# Altium schematic sheet SMPS.SchDoc
size A3; Organization: Altium Limited; Address1: L3, 12a Rodborough Rd; Address2: Frenchs Forest; Address3: NSW; Address4: Australia 2086
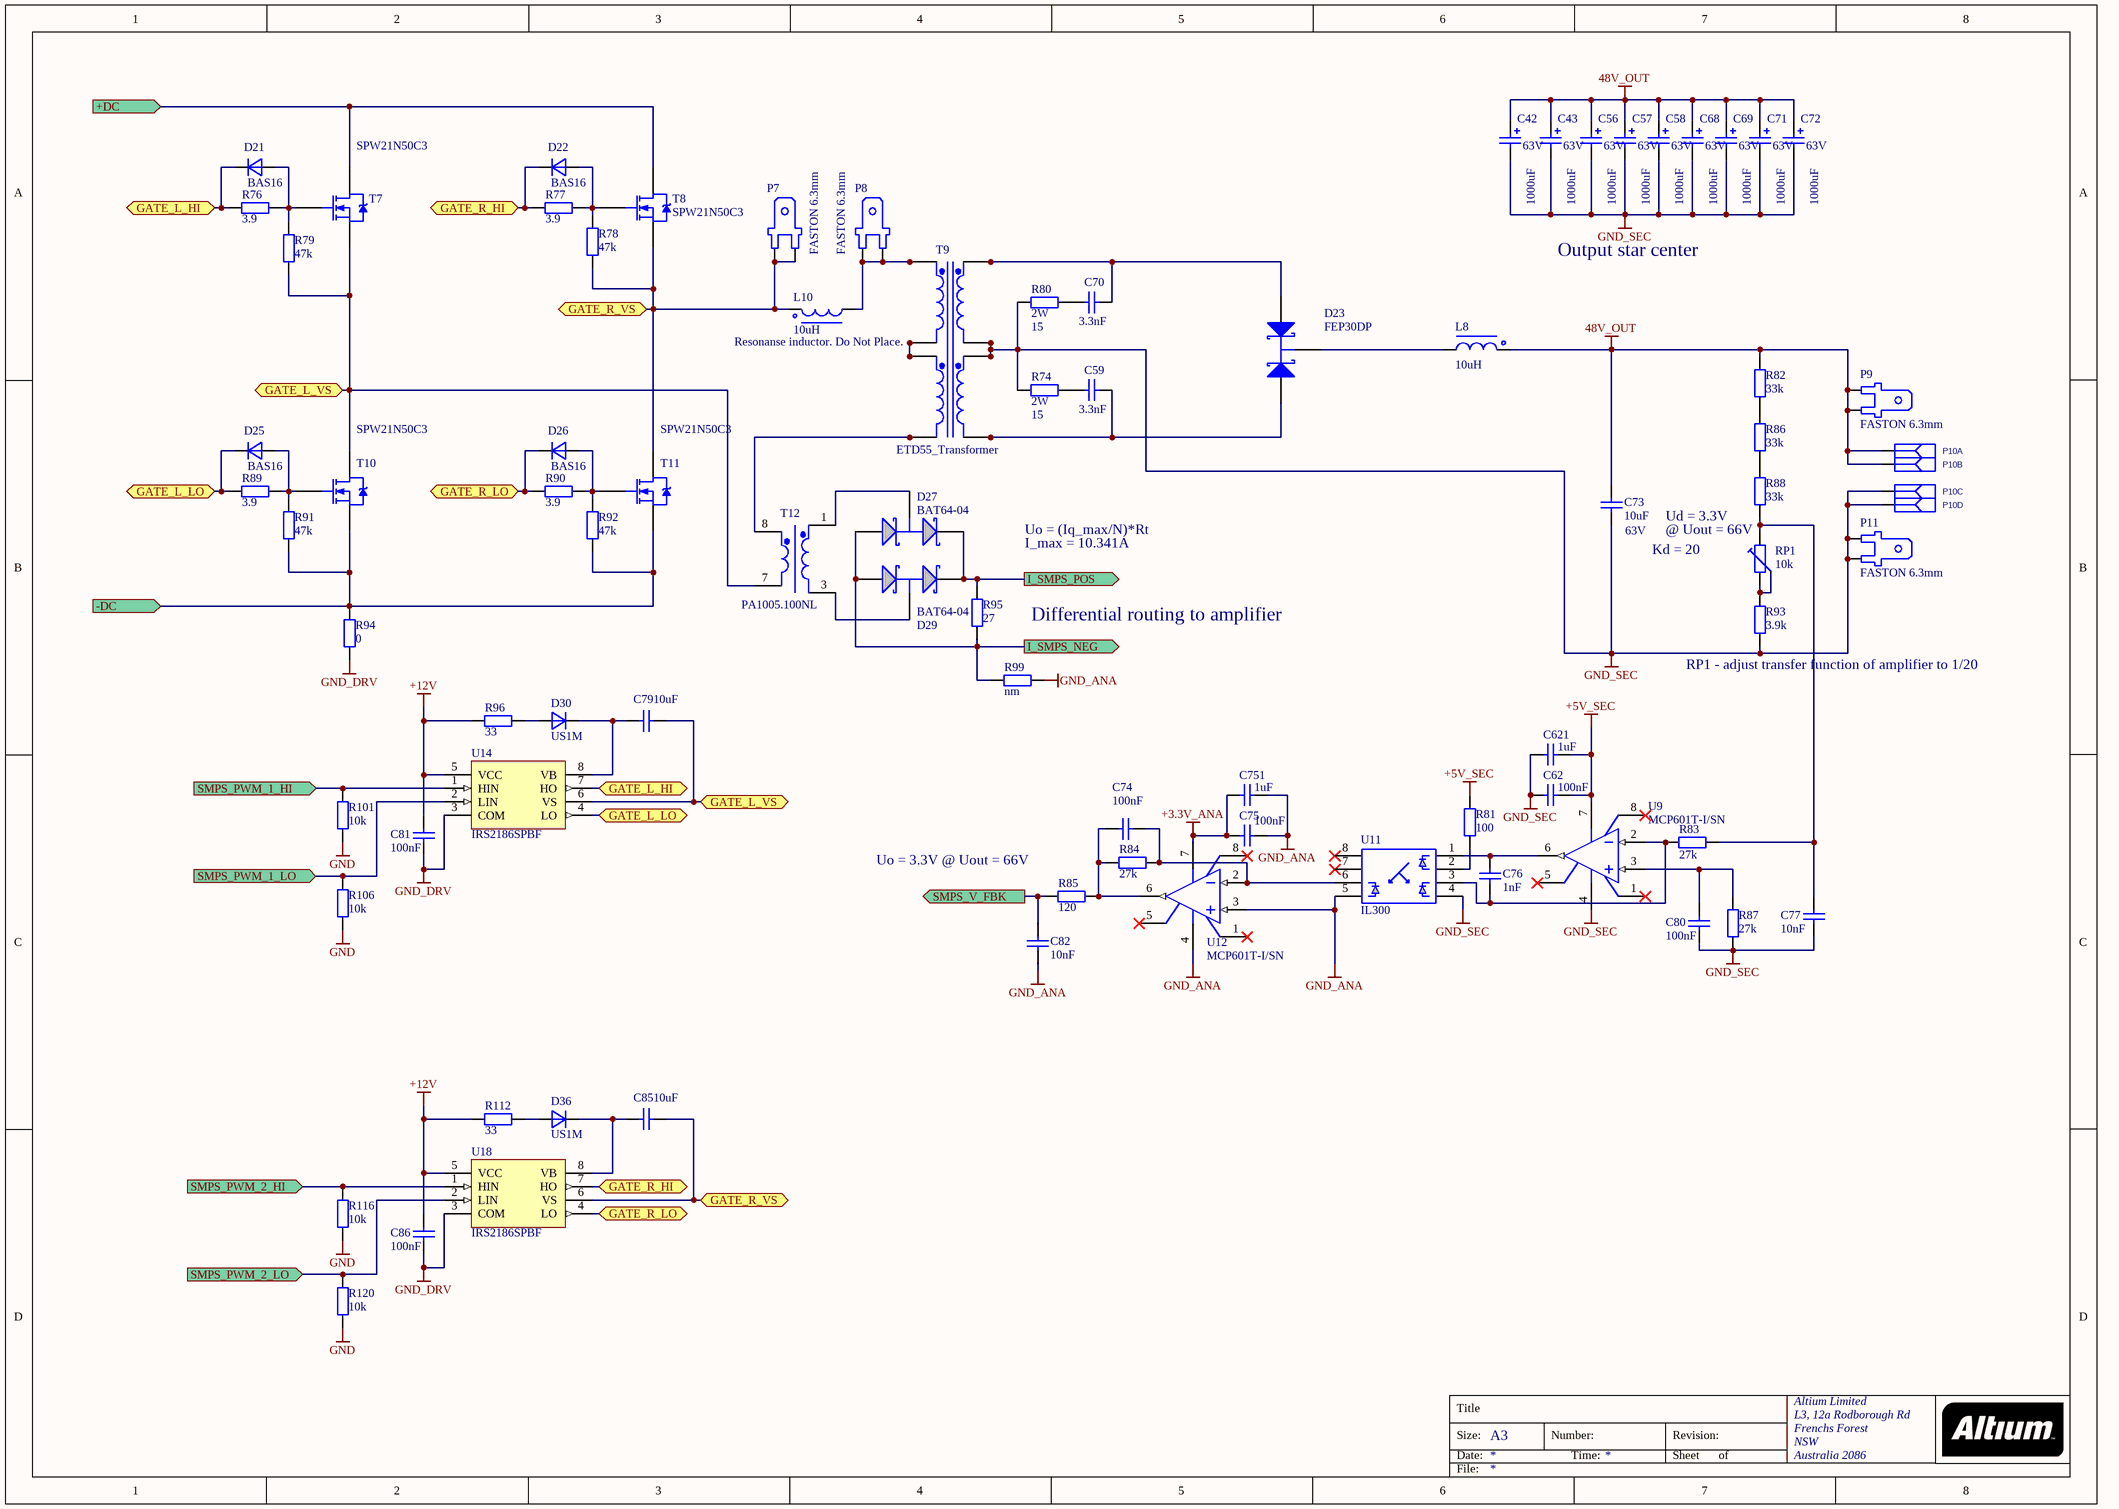
[diagram p0: SMPS.SchDoc]

## Parts
C42  value 1000uF  Voltage: 63V  [CAPPR7.5-18x35.5]  (hidden comment: Cap)
C43  value 1000uF  Voltage: 63V  [CAPPR7.5-18x35.5]  (hidden comment: Cap)
C56  value 1000uF  Voltage: 63V  [CAPPR7.5-18x35.5]  (hidden comment: Cap)
C57  value 1000uF  Voltage: 63V  [CAPPR7.5-18x35.5]  (hidden comment: Cap)
C58  value 1000uF  Voltage: 63V  [CAPPR7.5-18x35.5]  (hidden comment: Cap)
C59  value 3.3nF  [CAP26X19P22_5H]  (hidden comment: Cap)
C62  value 100nF  [1206_REFLOW]  (hidden comment: Cap 1206)
C68  value 1000uF  Voltage: 63V  [CAPPR7.5-18x35.5]  (hidden comment: Cap)
C69  value 1000uF  Voltage: 63V  [CAPPR7.5-18x35.5]  (hidden comment: Cap)
C70  value 3.3nF  [CAP26X19P22_5H]  (hidden comment: Cap)
C71  value 1000uF  Voltage: 63V  [CAPPR7.5-18x35.5]  (hidden comment: Cap)
C72  value 1000uF  Voltage: 63V  [CAPPR7.5-18x35.5]  (hidden comment: Cap)
C73  value 10uF  Voltage: 63V  [RECT 26.5X8.5 RM22.5]  (hidden comment: Cap)
C74  value 100nF  [1206_REFLOW]  (hidden comment: Cap 1206)
C75  value 100nF  [1206_REFLOW]  (hidden comment: Cap 1206)
C76  value 1nF  [1206_REFLOW]  (hidden comment: Cap 1206)
C77  value 10nF  [1206_REFLOW]  (hidden comment: Cap 1206)
C79  value 10uF  [1206_REFLOW]  (hidden comment: Cap 1206)
C80  value 100nF  [1206_REFLOW]  (hidden comment: Cap 1206)
C81  value 100nF  [1206_REFLOW]  (hidden comment: Cap 1206)
C82  value 10nF  [1206_REFLOW]  (hidden comment: Cap)
C85  value 10uF  [1206_REFLOW]  (hidden comment: Cap 1206)
C86  value 100nF  [1206_REFLOW]  (hidden comment: Cap 1206)
C621  value 1uF  [1206_REFLOW]  (hidden comment: Cap 1206)
C751  value 1uF  [1206_REFLOW]  (hidden comment: Cap 1206)
D21  BAS16  [SOT23_HIS_Primary]
D22  BAS16  [SOT23_HIS_Primary]
D23  value FEP30DP  [TO-247HV]  (hidden comment: DIODE, ULTRAFAST, 30 A, TO-3P)
D25  BAS16  [SOT23_HIS_Primary]
D26  BAS16  [SOT23_HIS_Primary]
D27  BAT64-04  [SOT23_HIS_Primary]
D29  BAT64-04  [SOT23_HIS_Primary]
D30  US1M  [DO-214_S1A(Primary)]
D36  US1M  [DO-214_S1A(Primary)]
L8  value 10uH  [BOURNS - SRP1270-100M]  (hidden comment: SRP1270-100M)
L10  Resonanse inductor. Do Not Place.  value 10uH  [BOURNS - SRP1270-100M]
P7  FASTON 6.3MM  [FASTON 6.3mm]
P8  FASTON 6.3MM  [FASTON 6.3mm]
P9  FASTON 6.3MM  [FASTON 6.3mm]
P10  MSTBA 2,5/ 4-G-5,08  [MSTBA2.5/4G-5.08]  (value not drawn)  (parts A,B,C,D of 4)
P11  FASTON 6.3MM  [FASTON 6.3mm]
R74  2W  value 15  [5.5x16mm (2W BODY RES)]
R76  value 3.9  [1206_REFLOW]  (hidden comment: RES)
R77  value 3.9  [1206_REFLOW]  (hidden comment: RES)
R78  value 47k  [1206_REFLOW]  (hidden comment: RES)
R79  value 47k  [1206_REFLOW]  (hidden comment: RES)
R80  2W  value 15  [5.5x16mm (2W BODY RES)]
R81  value 100  [1206_REFLOW]  (hidden comment: RES)
R82  value 33k  [1206_REFLOW]  (hidden comment: RES)
R83  value 27k  [1206_REFLOW]  (hidden comment: RES)
R84  value 27k  [1206_REFLOW]  (hidden comment: RES)
R85  value 120  [1206_REFLOW]  (hidden comment: RES)
R86  value 33k  [1206_REFLOW]  (hidden comment: RES)
R87  value 27k  [1206_REFLOW]  (hidden comment: RES)
R88  value 33k  [1206_REFLOW]  (hidden comment: RES)
R89  value 3.9  [1206_REFLOW]  (hidden comment: RES)
R90  value 3.9  [1206_REFLOW]  (hidden comment: RES)
R91  value 47k  [1206_REFLOW]  (hidden comment: RES)
R92  value 47k  [1206_REFLOW]  (hidden comment: RES)
R93  value 3.9k  [1206_REFLOW]  (hidden comment: RES)
R94  value 0  [1206_REFLOW]  (hidden comment: RES)
R95  value 27  [1206_REFLOW]  (hidden comment: RES)
R96  value 33  [1206_REFLOW]  (hidden comment: RES)
R99  value nm  [1206_REFLOW]  (hidden comment: RES)
R101  value 10k  [1206_REFLOW]  (hidden comment: RES)
R106  value 10k  [1206_REFLOW]  (hidden comment: RES)
R112  value 33  [1206_REFLOW]  (hidden comment: RES)
R116  value 10k  [1206_REFLOW]  (hidden comment: RES)
R120  value 10k  [1206_REFLOW]  (hidden comment: RES)
RP1  value 10k  [BOURNS3296W]  (hidden comment: Trimmer)
T7  value SPW21N50C3  [TO-247HV]  (hidden comment: MOSFET, N, 500V, TO-247)
T8  value SPW21N50C3  [TO-247HV]  (hidden comment: MOSFET, N, 500V, TO-247)
T9  ETD55_Transformer  [ETD54_Transformer]
T10  value SPW21N50C3  [TO-247HV]  (hidden comment: MOSFET, N, 500V, TO-247)
T11  value SPW21N50C3  [TO-247HV]  (hidden comment: MOSFET, N, 500V, TO-247)
T12  value PA1005.100NL  [PA1005.XXXNL Series]  (hidden comment: PA1005.XXXNL)
U9  MCP601T-I/SN  [SOIC-SN8_N]
U11  value IL300  [DIP8 6n138]  (hidden comment: Analog optocoupler)
U12  MCP601T-I/SN  [SOIC-SN8_N]
U14  IRS2186SPBF  [SO-8_N]
U18  IRS2186SPBF  [SO-8_N]

## Ports
+DC (in), -DC (in), GATE_L_HI (bidir), GATE_L_LO (bidir), GATE_L_VS (bidir), GATE_R_HI (bidir), GATE_R_LO (bidir), GATE_R_VS (bidir), I_SMPS_NEG (out), I_SMPS_POS (out), SMPS_PWM_1_HI (in), SMPS_PWM_1_LO (in), SMPS_PWM_2_HI (in), SMPS_PWM_2_LO (in), SMPS_V_FBK (out)

## Nets
48V_OUT: C42.1 C43.1 C56.1 C57.1 C58.1 C68.1 C69.1 C71.1 C72.1 C73.2 L8.2 P9.1 P9.2 P10.1(SIG) P10.2(SIG) R82.1
+3.3V_ANA: C75.1 C751.1 U12.7(VDD)
+5V_SEC: C62.2 C621.2 R81.1 U9.7(VDD)
+12V: C81.1 C86.1 R96.1 R112.1 U14.5(VCC) U18.5(VCC)
GND: R101.1 R106.1 R116.1 R120.1
GND_ANA: C75.2 C82.1 C751.2 R99.2 U11.5(GND) U12.3(VIN+) U12.4(VSS)
GND_DRV: C81.2 C86.2 R94.2 U14.3(COM) U18.3(COM)
GND_SEC: C42.2 C43.2 C56.2 C57.2 C58.2 C62.1 C68.2 C69.2 C71.2 C72.2 C73.1 C77.1 C80.1 C621.1 P10.3(SIG) P10.4(SIG) P11.1 P11.2 R74.2 R80.2 R87.2 R93.2 T9.14(Sec2+) T9.15(Sec2+) T9.19(Sec2+) T9.20(Sec2+) U9.4(VSS) U11.4
+DC: T7.2(D) T8.2(D) ; port +DC
-DC: R91.2 R92.1 R94.1 T10.3(S) T11.3(S) ; port -DC
GATE_L_HI: D21.3(K) R76.1 U14.7(HO) ; port GATE_L_HI
GATE_L_LO: D25.3(K) R89.2 U14.4(LO) ; port GATE_L_LO
GATE_L_VS: C79.1 R79.1 T7.3(S) T10.2(D) T12.7(Pri-) U14.6(VS) ; port GATE_L_VS
GATE_R_HI: D22.3(K) R77.2 U18.7(HO) ; port GATE_R_HI
GATE_R_LO: D26.3(K) R90.1 U18.4(LO) ; port GATE_R_LO
GATE_R_VS: C85.1 L10.2 P7.1 P7.2 R78.2 T8.3(S) T11.2(D) U18.6(VS) ; port GATE_R_VS
I_SMPS_NEG: D27.1(A) D29.1(A) R95.2 R99.1 ; port I_SMPS_NEG
I_SMPS_POS: D27.2(K) D29.2(K) R95.1 ; port I_SMPS_POS
SMPS_PWM_1_HI: R101.2 U14.1(HIN) ; port SMPS_PWM_1_HI
SMPS_PWM_1_LO: R106.2 U14.2(LIN) ; port SMPS_PWM_1_LO
SMPS_PWM_2_HI: R116.2 U18.1(HIN) ; port SMPS_PWM_2_HI
SMPS_PWM_2_LO: R120.2 U18.2(LIN) ; port SMPS_PWM_2_LO
SMPS_V_FBK: C82.2 R85.1 ; port SMPS_V_FBK
NetC59_1: C59.1 R74.1
NetC59_2: C59.2 D23.3(A2) T9.12(Sec2+) T9.13(Sec2+)
NetC70_1: C70.1 R80.1
NetC70_2: C70.2 D23.1(A1) T9.21(Sec1+) T9.22(Sec1+)
NetC74_1: C74.1 R84.1 R85.2 U12.6(VOUT)
NetC74_2: C74.2 R84.2 U11.6(O2) U12.2(VIN-)
NetC76_1: C76.1 U9.6(VOUT) U11.1
NetC76_2: C76.2 R83.1 U9.2(VIN-) U11.3
NetC77_2: C77.2 R83.2 R88.2 RP1.3
NetC79_2: C79.2 D30.K U14.8(VB)
NetC80_2: C80.2 R87.1 U9.3(VIN+)
NetC85_2: C85.2 D36.K U18.8(VB)
NetD21_1: D21.1(A) R76.2 R79.2 T7.1(G)
NetD22_1: D22.1(A) R77.1 R78.1 T8.1(G)
NetD23_2: D23.2(K) L8.1
NetD25_1: D25.1(A) R89.1 R91.1 T10.1(G)
NetD26_1: D26.1(A) R90.2 R92.2 T11.1(G)
NetD27_3: D27.3(C) T12.3(Sec2+)
NetD29_3: D29.3(C) T12.1(Sec1+)
NetD30_A: D30.A R96.2
NetD36_A: D36.A R112.2
NetL10_1: L10.1 P8.1 P8.2 T9.1(Pri+) T9.2(Pri+)
NetR81_2: R81.2 U11.2
NetR82_2: R82.2 R86.1
NetR86_2: R86.2 R88.1
NetR93_1: R93.1 RP1.1 RP1.2
NetT9_3: T9.3(Pri-) T9.4(Pri+) T9.8(Pri+) T9.9(Pri+)
NetT9_10: T9.10(Pri-) T9.11(Pri+) T12.8(Pri+)

Not connected (* = marked no-connect by the designer): D21 2(NC); D22 2(NC); D25 2(NC); D26 2(NC); U9 1(NC)* 5(NC)* 8(NC)*; U11 7(O1)* 8*; U12 1(NC)* 5(NC)* 8(NC)*

## Notes on the sheet
- Output star center
- Uo = (Iq_max/N)*Rt
- I_max = 10.341A
- Kd = 20
- Ud = 3.3V
- (near RP1) @ Uout = 66V
- Differential routing to amplifier
- (near R93) RP1 - adjust transfer function of amplifier to 1/20
- (near R85) Uo = 3.3V @ Uout = 66V
- Title
- Size:
- Date:
- A3
- Number:
- Time:
- Revision:
- Sheet
- of
- File:

## Library data of the parts
C42 C43 C56-C58 C68 C69 C71 C72 = Cap pol: Manufacturer: *; Manufacturer Order Code: *; Supplier Order Code: *
C73 = Cap: Manufacturer: WIMA; Manufacturer Order Code: MKS4C051005F00KSSD; Supplier Order Code: CW 10uF 63V 10% MKS4
D21 D22 D25 D26 = BAS16: DIODE, SINGLE SOT-23; Manufacturer: Any; Group: Discrete; Subgroup1: Small Signal; Order Code: BAS16 SMD (SOT23); Subgroup: Diode; Package: SOT23; Mounting: SMD; Supplier: Comet; Value: BAS16
D23 = FEP30DP: Schottky Rectifier; Manufacturer: VISHAY GENERAL SEMICONDUCTOR; Order Code: 1612308
D27 D29 = BAT64-04: Silicon Schottky Diodes; Manufacturer: INF; ComponentLink1DescBC: Manufacturer Link; Group: Discrete; Subgroup: Diode; Published: 21-Mar-2003; DatasheetDocument: Oct-1999; PackageDocument: Sep-2001; PackageReference: SOT-23; Publisher: Altium Limited; ComponentLink1URL: http://www.infineon.com/; Value: BAT64-04
D30 D36 = S1A: Value: US1M
L8 L10 = BOURNS - SRP1270-xxxM: BOURNS - SRP1270-100M - INDUCTOR, SMD, 10UH, 16A; Order Code: 1828128; Rated Current: 16A; Manufacturer: Bourns; Manufacturer Order Code: SRP1270-100M
P10 = MSTBA 2,5/ 4-G-5,08: Header, right angled, 12 A, 250 V, pitch 5.08 mm, No. of poles:4; Manufacturer: Phoenix; Mfrr. Part No.: 1757268; Group: Connector; Subgroup: Industrial; Value: MSTBA2,5/4; Mounting: TH; Supplier: Any; Order Code: *
R74 R76-R81 R83-R85 R87 R89-R92 R94-R96 R99 R101 R106 R112 R116 R120 = RES 1
  R81 R83-R85 R87 R94-R96 R99 R112: Tolerance: *
R82 R86 R88 R93 = RES 1: Tolerance: 1%
RP1 = Res Trim: Tolerance: *
T7 T8 T10 T11 = SPW21N50C3: INFINEON - SPW21N50C3 - MOSFET, N, 500V, TO-247; Farnell Order Code: 1471815
T9 = ETD55_Transformer: Core Manufacturer: Kashke; Primary Voltage: 400V; Secondary Voltage: 2x24V; Core Material Type: EPCOS; Core Geometry: ETD54; Primary Turns: *; Secondary Turns: *; Primary Wire Size: *; Secondary Wire Size: *
T12 = PA1005.XXXNL Series: Manufacturer: PULSE ELECTRONICS CORPORATION; Current Rating: 20A; Turns Ratio - Primary:Secondary: *; Inductance: *; DC Resistance (DCR): *
U9 U12 = MCP601T-I/SN: 2.7V to 6.0V Single Supply CMOS Operational Amplifier, 8-Pin SOIC, Industrial Temperature, Tape and Reel; Published: 29-Jan-2009; DatasheetVersion: revG, Dec-2007; PackageVersion: revAW, Oct-2008; PackageReference: SOIC-SN8; Publisher: Altium Limited; PackageDescription: 8-Lead Plastic Small Outline (SN) - Narrow, 3.90mm Body [SOIC]; Code_JEDEC: MS-012; Code_IPC: SOIC127P600-8; ComponentLink1Description: Manufacturer Link; ComponentLink1URL: http://www.microchip.com; ComponentLink2Description: Datasheet; ComponentLink2URL: http://ww1.microchip.com/downloads/en/DeviceDoc/21314g.pdf; ComponentLink3Description: Packaging Specification; ComponentLink3URL: http://ww1.microchip.com/downloads/en/PackagingSpec/00049AW.pdf
U11 = IL300
U14 U18 = IRS2186SPBF: Half-Bridge Driver; Published: 8-Jun-2000; LatestRevisionDate: 13-Apr-2006; LatestRevisionNote: IPC-7351 Footprint Added.; DatasheetVersion: PD60028J; PackageVersion: Feb-2001; PackageReference: SO-8; Publisher: Altium Limited; PackageDescription: 8-Pin Plastic Small Outline Integrated Circuit 1.27 mm Pitch; Code_JEDEC: MS-012-AA; Code_IPC: SOIC127P600-8; ComponentLink1Description: Manufacturer Link; ComponentLink1URL: http://www.irf.com/; ComponentLink2Description: Datasheet
C59 C70 C82 = Cap: Voltage: *; Manufacturer: *
  C59 C70: Order Code: *
  C82: Supplier Order Code: *; Manufacturer Order Code: *; Supplier: *
C62 C74-C77 C79-C81 C85 C86 C621 C751 = Cap 1206: Supplier: *; Supplier Order Code: *; Manufacturer: *; Manufacturer Order Code: *; Voltage: *; Tolerance: *; Series: *
P7-P9 P11 = FASTON 6.3MM: Value: FASTON 6.3mm